# Altium project base-board_2.PrjPcb
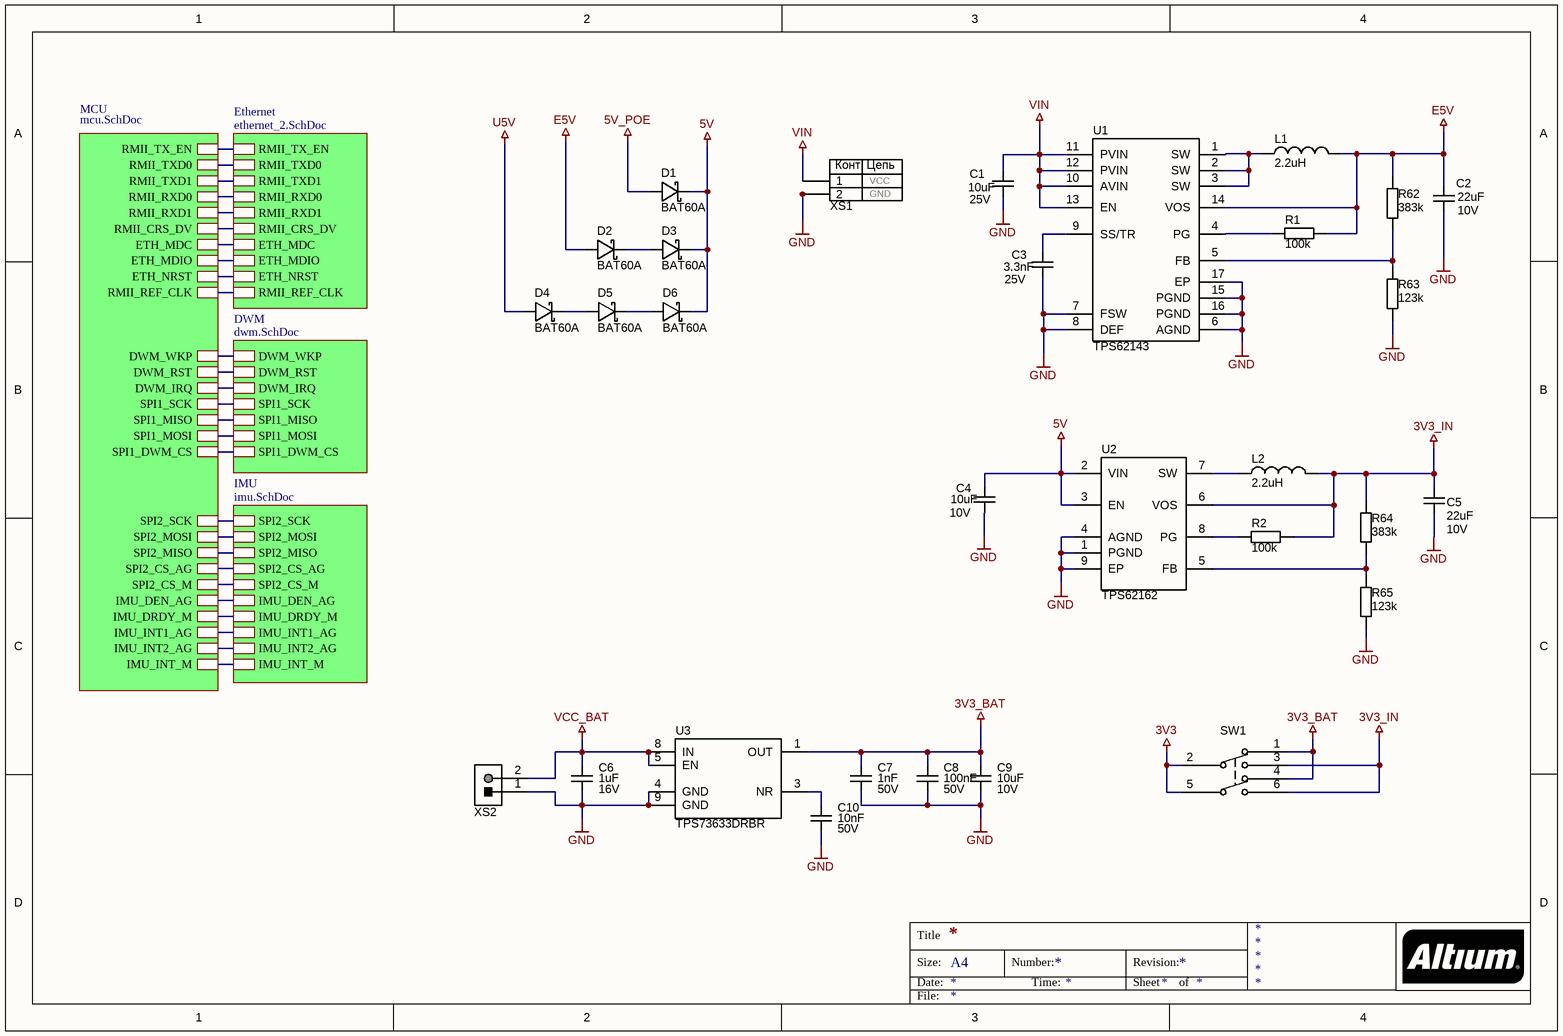
[diagram p0: base-board_2.SchDoc]
5 sheets, 193 parts. Net scope: hierarchical (ports join the sheet entries above them; power ports are global).
Board file: base-board_2.PcbDoc
Sheets:
  base-board_2.SchDoc
    Ethernet = ethernet_2.SchDoc
    MCU = mcu.SchDoc
    DWM = dwm.SchDoc
    IMU = imu.SchDoc

## Sheet base-board_2.SchDoc
size A4

### Parts
C1  value 10uF  Voltage: 25V  [C1210]  (hidden comment: C1210)
C2  value 22uF  Voltage: 10V  [C1210]  (hidden comment: C1210)
C3  value 3.3nF  Voltage: 25V  [C0603]  (hidden comment: C0603)
C4  value 10uF  Voltage: 10V  [C0805]  (hidden comment: C0805)
C5  value 22uF  Voltage: 10V  [C0805]  (hidden comment: C0805)
C6  value 1uF  Voltage: 16V  [C0805]  (hidden comment: C0805)
C7  value 1nF  Voltage: 50V  [C0805]  (hidden comment: C0805)
C8  value 100nF  Voltage: 50V  [C0603]  (hidden comment: C0603)
C9  value 10uF  Voltage: 10V  [C0603]  (hidden comment: C0603)
C10  value 10nF  Voltage: 50V  [C0603]  (hidden comment: C0603)
D1  BAT60A  [SOD-323-2]
D2  BAT60A  [SOD-323-2]
D3  BAT60A  [SOD-323-2]
D4  BAT60A  [SOD-323-2]
D5  BAT60A  [SOD-323-2]
D6  BAT60A  [SOD-323-2]
L1  value 2.2uH  [IND2220]  (hidden comment: LQH55PN2R2NR0)
L2  value 2.2uH  [IND2220]  (hidden comment: LQH55PN2R2NR0)
R1  value 100k  [SMD0603]  (hidden comment: R0603)
R2  value 100k  [SMD0603]  (hidden comment: R0603)
R62  value 383k  [SMD0603]  (hidden comment: R0603)
R63  value 123k  [SMD0603]  (hidden comment: R0603)
R64  value 383k  [SMD0603]  (hidden comment: R0603)
R65  value 123k  [SMD0603]  (hidden comment: R0603)
SW1  JS202011SCQN  [JS202011SCQN]  (value not drawn)
U1  TPS62143  [QFN-16]
U2  TPS62162  [SON-8]
U3  TPS73633DRBR  [VSON-8]
XS1  PowerJack  [PowerJack]  (value not drawn)
XS2  S2B-PH-K-S  [S2B-PH-K-S]  (value not drawn)

### Sub-sheets
DWM = dwm.SchDoc: DWM_WKP, DWM_RST, DWM_IRQ, SPI1_SCK, SPI1_MISO, SPI1_MOSI, SPI1_DWM_CS
Ethernet = ethernet_2.SchDoc: RMII_TX_EN, RMII_TXD0, RMII_TXD1, RMII_RXD0, RMII_RXD1, RMII_CRS_DV, ETH_MDC, ETH_MDIO, ETH_NRST, RMII_REF_CLK
IMU = imu.SchDoc: SPI2_SCK, SPI2_MOSI, SPI2_CS_M, IMU_DRDY_M, IMU_INT_M, IMU_INT2_AG, IMU_INT1_AG, SPI2_CS_AG, IMU_DEN_AG, SPI2_MISO
MCU = mcu.SchDoc: IMU_INT_M, IMU_DRDY_M, IMU_INT1_AG, IMU_INT2_AG, SPI2_CS_AG, IMU_DEN_AG, SPI2_CS_M, RMII_RXD0, RMII_RXD1, ETH_MDC, RMII_REF_CLK, ETH_MDIO, SPI2_SCK, RMII_TX_EN, RMII_TXD0, RMII_TXD1, SPI2_MISO, SPI2_MOSI, SPI1_MOSI, SPI1_MISO, RMII_CRS_DV, SPI1_SCK, SPI1_DWM_CS, DWM_WKP, DWM_RST, DWM_IRQ, ETH_NRST

### Nets
3V3: SW1.2(COM) SW1.5(COM)
3V3_BAT: C7.2 C8.2 C9.2 SW1.1 SW1.4 U3.1(OUT)
3V3_IN: C5.2 L2.2 R2.2 R64.2 SW1.3 SW1.6 U2.6(VOS)
5V: C4.2 D1.2(K) D3.2(K) D6.2(K) U2.2(VIN) U2.3(EN)
5V_POE: D1.1(A)
E5V: C2.2 D2.1(A) L1.2 R1.2 R62.2 U1.14(VOS)
GND: C1.1 C2.1 C3.1 C4.1 C5.1 C6.1 C7.1 C8.1 C9.1 C10.1 R63.1 R65.1 U1.6(AGND) U1.7(FSW) U1.8(DEF) U1.15(PGND) U1.16(PGND) U1.17(EP) U2.1(PGND) U2.4(AGND) U2.9(EP) U3.4(GND) U3.9(GND) XS1.2 XS1.3 XS2.1
U5V: D4.1(A)  [project net USB_VBUS]
VCC_BAT: C6.2 U3.5(EN) U3.8(IN) XS2.2
VIN: C1.2 U1.10(AVIN) U1.11(PVIN) U1.12(PVIN) U1.13(EN) XS1.1
DWM_CS: sheet MCU/SPI1_DWM_CS, sheet DWM/SPI1_DWM_CS
DWM_MISO: sheet MCU/SPI1_MISO, sheet DWM/SPI1_MISO
DWM_MOSI: sheet MCU/SPI1_MOSI, sheet DWM/SPI1_MOSI
DWM_SCK: sheet MCU/SPI1_SCK, sheet DWM/SPI1_SCK
RESET: sheet Ethernet/ETH_NRST, sheet MCU/ETH_NRST
NetC3_2: C3.2 U1.9(SS/TR)
NetC10_2: C10.2 U3.3(NR)
NetD2_2: D2.2(K) D3.1(A)
NetD4_2: D4.2(K) D5.1(A)
NetD5_2: D5.2(K) D6.1(A)
NetL1_1: L1.1 U1.1(SW) U1.2(SW) U1.3(SW)
NetL2_1: L2.1 U2.7(SW)
NetR1_1: R1.1 U1.4(PG)
NetR2_1: R2.1 U2.8(PG)
NetR8_2: sheet MCU/DWM_IRQ, sheet DWM/DWM_IRQ
NetR21_1: sheet Ethernet/ETH_MDIO, sheet MCU/ETH_MDIO
NetR22_1: sheet Ethernet/RMII_REF_CLK, sheet MCU/RMII_REF_CLK
NetR23_2: sheet Ethernet/RMII_RXD0, sheet MCU/RMII_RXD0
NetR24_2: sheet Ethernet/RMII_RXD1, sheet MCU/RMII_RXD1
NetR27_2: sheet Ethernet/RMII_CRS_DV, sheet MCU/RMII_CRS_DV
NetR62_1: R62.1 R63.2 U1.5(FB)
NetR64_1: R64.1 R65.2 U2.5(FB)
NetU4_16: sheet Ethernet/ETH_MDC, sheet MCU/ETH_MDC
NetU4_39: sheet MCU/DWM_WKP, sheet DWM/DWM_WKP
NetU4_40: sheet MCU/DWM_RST, sheet DWM/DWM_RST
NetU4_47: sheet MCU/SPI2_SCK, sheet IMU/SPI2_SCK
NetU4_48: sheet Ethernet/RMII_TX_EN, sheet MCU/RMII_TX_EN
NetU4_51: sheet Ethernet/RMII_TXD0, sheet MCU/RMII_TXD0
NetU4_52: sheet Ethernet/RMII_TXD1, sheet MCU/RMII_TXD1
NetU4_53: sheet MCU/SPI2_MISO, sheet IMU/SPI2_MISO
NetU4_54: sheet MCU/SPI2_MOSI, sheet IMU/SPI2_MOSI
NetU4_55: sheet MCU/IMU_DEN_AG, sheet IMU/IMU_DEN_AG
NetU4_56: sheet MCU/SPI2_CS_AG, sheet IMU/SPI2_CS_AG
NetU4_57: sheet MCU/SPI2_CS_M, sheet IMU/SPI2_CS_M
NetU4_58: sheet MCU/IMU_DRDY_M, sheet IMU/IMU_DRDY_M
NetU4_59: sheet MCU/IMU_INT1_AG, sheet IMU/IMU_INT1_AG
NetU4_60: sheet MCU/IMU_INT2_AG, sheet IMU/IMU_INT2_AG
NetU4_61: sheet MCU/IMU_INT_M, sheet IMU/IMU_INT_M

### Notes on the sheet
- Title
- Size:
- Date:
- A4
- Number:
- Time:
- Revision:
- Sheet
- of
- File:
- (in symbol PowerJack) Конт; Цепь; VCC; GND

### Library data of the parts
D1-D6 = BAT60J: Shottky Diode 10V 3A
L1 L2 = LQH55PN2R2NR0: FIXED IND 2.2UH 2.5A 31 MOHM SMD; Model: LQH55PN2R2NR0
SW1 = JS202011SCQN: Switch Slide DPDT, 0.3 A, 6 V, -40 to 85 degC, 6-Pin SMD, RoHS, Tape and Reel; Manufacturer: C&K Components; Contact Rating @ Voltage: 0.3@6VDCA; COO: US; Maximum DC Voltage Rating: 6V; Minimum Insulation Resistance: 100MOhm; Actuator Color: Black; Body Orientation: Straight; Actuator Material: Nylon4/6; Dielectric Strength: 500VAC; Maximum Contact Resistance: 70mOhm; Actuator Style: TopSlide; Electrical Life: 15000Cycles; Seal Location: N/A; Base Material: N/A; Mechanical Life: N/A; Switch Configuration: N/A; HTS: 8536509050; Contact Material: CopperAlloy; Supplier Standard Pack: 5,000; Manufacturer URL: http://www.ckswitches.com; Supplier: C&KComponents; Datasheet URL: http://datasheet.octopart.com/JS202011SCQN-C%26K-Components-datasheet-62100994.pdf; Housing Material: Nylon4/6; Product Weight: N/A; Dimension: 9x7.5x5.5mm; Maximum AC Voltage Rating: N/A; ECCN: EAR99; Contact Plating: Silver; Pole Throw Configuration: DPDT; Packaging: TapeandReel; Part No: JS202011SCQN; Datasheet Version: Sep-15; Seal Description: N/A; RoHS: Yes; Mounting: SurfaceMount,GullWing; Family: JS; Type: Sub-Miniature; Operating Temperature: -40to85C
U1 = TPS62143RGT16: Buck 2A TI Fix 5V
U2 = TPS62162DSG8: Buck 1A TI Fix 3.3V
U3 = TPS73633DRBR: IC REG LINEAR 3.3V 400MA 8SON
XS2 = S2B-PH-K-S: Male Header, Pitch 2 mm, 1 x 2 Position, Height 4.8 mm, Tail Length 3.4 mm, -25 to 85 degC, RoHS, Bulk; Case\Package: Radial; Tolerance: 20%; Capacitance: 10 uF; Voltage Rating (DC): 50 V; Packaging: Bulk; ComponentLink1URL: http://www.jst-mfg.com/product/pdf/eng/ePH.pdf; Radiation Hardening: No; Height: 11 mm; Package Quantity: 200; PackageDescription: Male Header, Pitch 2 mm, 1 x 2 Position, Height 4.8 mm, Tail Length 3.4 mm; PackageReference: S2B-PH-K-S; Diameter: 5 mm; Pins: 2; Mount: Through Hole; Max Operating Temperature: 85 degC; Min Operating Temperature: -40 degC; ComponentLink1Description: Datasheet; DatasheetVersion: Dec-12; Length: 11 mm; Lead Pitch: 2 mm; REACH SVHC: No SVHC; Voltage Rating: 50 V; RoHSCompliant: true
C1 C2 = C1210: Model: *
C3 C8-C10 = C0603: Model: *
C4-C7 = C0805: Model: *

## Sheet ethernet_2.SchDoc
size A2; Scale: 1:1; DocumentType: Схема электрическая принципиальная; FirstReferrence: АБВГ.123456.001
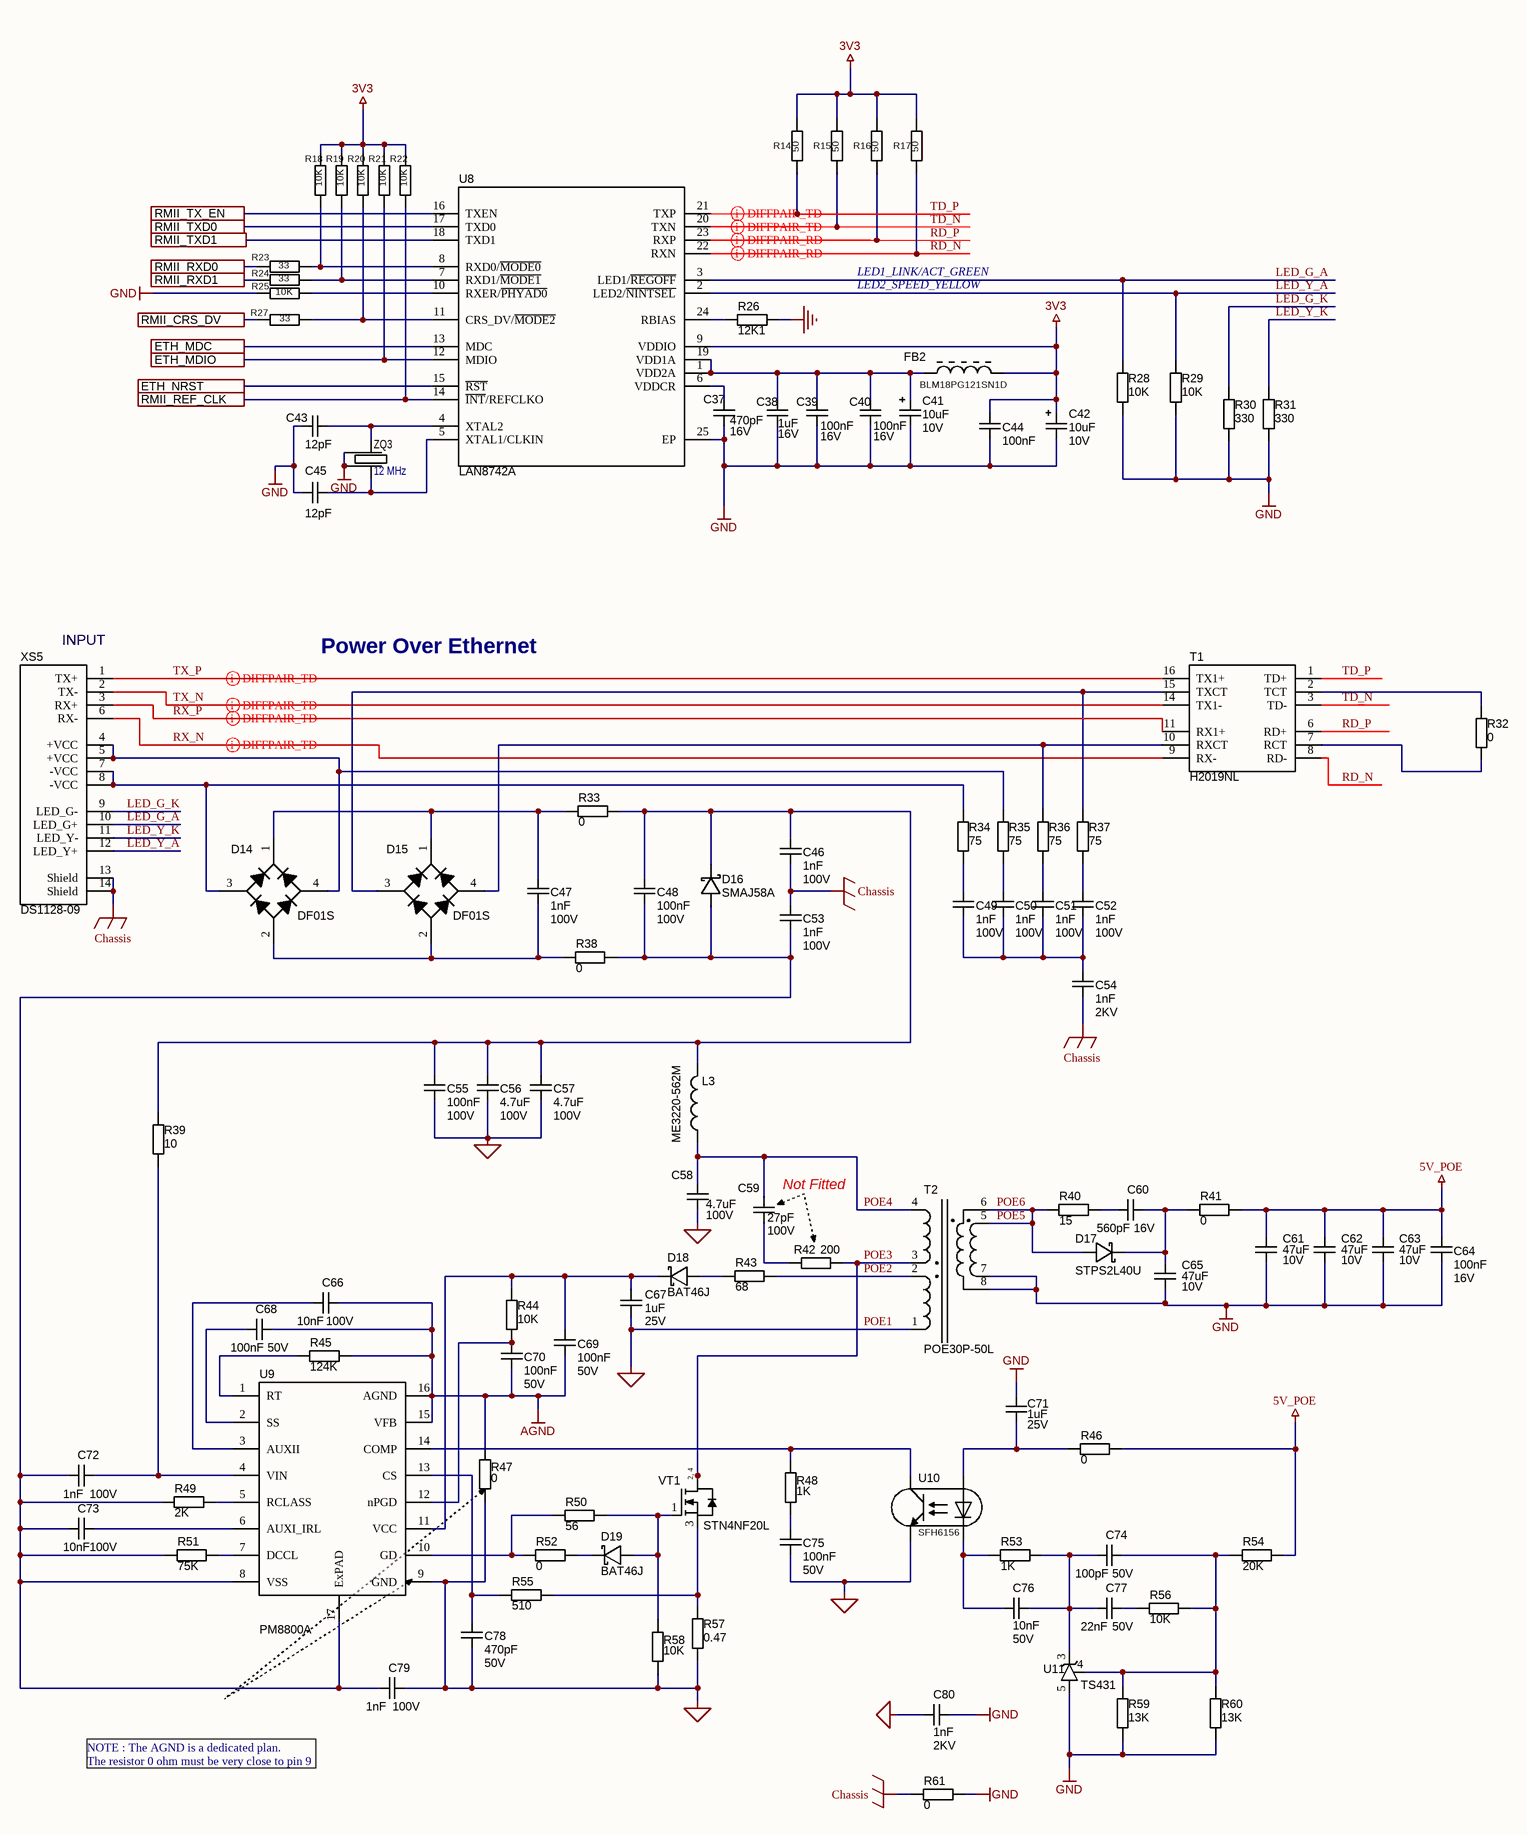
[diagram p1: ethernet_2.SchDoc]

### Parts
C37  value 470pF  Voltage: 16V  [C0603]  (hidden comment: C0603)
C38  value 1uF  Voltage: 16V  [C0603]  (hidden comment: C0603)
C39  value 100nF  Voltage: 16V  [C0603]  (hidden comment: C0603)
C40  value 100nF  Voltage: 16V  [C0603]  (hidden comment: C0603)
C41  value 10uF  Voltage: 10V  [TPSA106K010R1800]  (hidden comment: TPSA106K010R0900)
C42  value 10uF  Voltage: 10V  [TPSA106K010R1800]  (hidden comment: TPSA106K010R0900)
C43  value 12pF  [C0603]  (hidden comment: C0603)
C44  value 100nF  [C0603]  (hidden comment: C0603)
C45  value 12pF  [C0603]  (hidden comment: C0603)
C46  value 1nF  Voltage: 100V  [C0603]  (hidden comment: C0603)
C47  value 1nF  Voltage: 100V  [C0603]  (hidden comment: C0603)
C48  value 100nF  Voltage: 100V  [C0805]  (hidden comment: C0805)
C49  value 1nF  Voltage: 100V  [C0603]  (hidden comment: C0603)
C50  value 1nF  Voltage: 100V  [C0603]  (hidden comment: C0603)
C51  value 1nF  Voltage: 100V  [C0603]  (hidden comment: C0603)
C52  value 1nF  Voltage: 100V  [C0603]  (hidden comment: C0603)
C53  value 1nF  Voltage: 100V  [C0603]  (hidden comment: C0603)
C54  value 1nF  Voltage: 2KV  [C1206(3216)]  (hidden comment: C1206)
C55  value 100nF  Voltage: 100V  [C0805]  (hidden comment: C0805)
C56  value 4.7uF  Voltage: 100V  [C2220]  (hidden comment: C2220)
C57  value 4.7uF  Voltage: 100V  [C2220]  (hidden comment: C2220)
C58  value 4.7uF  Voltage: 100V  [C2220]  (hidden comment: C2220)
C59  value 27pF  Voltage: 100V  [C0603]  (hidden comment: C0603)
C60  value 560pF  Voltage: 16V  [C0603]  (hidden comment: C0603)
C61  value 47uF  Voltage: 10V  [C0805]  (hidden comment: C0805)
C62  value 47uF  Voltage: 10V  [C0805]  (hidden comment: C0805)
C63  value 47uF  Voltage: 10V  [C0805]  (hidden comment: C0805)
C64  value 100nF  Voltage: 16V  [C0603]  (hidden comment: C0603)
C65  value 47uF  Voltage: 10V  [C0805]  (hidden comment: C0805)
C66  value 10nF  Voltage: 100V  [C0603]  (hidden comment: C0603)
C67  value 1uF  Voltage: 25V  [C0603]  (hidden comment: C0603)
C68  value 100nF  Voltage: 50V  [C0603]  (hidden comment: C0603)
C69  value 100nF  Voltage: 50V  [C0603]  (hidden comment: C0603)
C70  value 100nF  Voltage: 50V  [C0603]  (hidden comment: C0603)
C71  value 1uF  Voltage: 25V  [C0603]  (hidden comment: C0603)
C72  value 1nF  Voltage: 100V  [C0603]  (hidden comment: C0603)
C73  value 10nF  Voltage: 100V  [C0603]  (hidden comment: C0603)
C74  value 100pF  Voltage: 50V  [C0603]  (hidden comment: C0603)
C75  value 100nF  Voltage: 50V  [C0603]  (hidden comment: C0603)
C76  value 10nF  Voltage: 50V  [C0603]  (hidden comment: C0603)
C77  value 22nF  Voltage: 50V  [C0603]  (hidden comment: C0603)
C78  value 470pF  Voltage: 50V  [C0603]  (hidden comment: C0603)
C79  value 1nF  Voltage: 100V  [C0603]  (hidden comment: C0603)
C80  value 1nF  Voltage: 2KV  [C1206(3216)]  (hidden comment: C1206)
D14  DF01S  [SDIP-4]
D15  DF01S  [SDIP-4]
D16  SMAJ58A  [DO-214AC-2_N]
D17  STPS2L40U  [SMB-2]
D18  BAT46J  [SOD-323-2]
D19  BAT46J  [SOD-323-2]
FB2  BLM18PG121SN1D  [BLM18]
L3  Model: ME3220-562M  [ME3220]  (hidden comment: ME3220)
R14  value 50  [SMD0603]  (hidden comment: R0603)
R15  value 50  [SMD0603]  (hidden comment: R0603)
R16  value 50  [SMD0603]  (hidden comment: R0603)
R17  value 50  [SMD0603]  (hidden comment: R0603)
R18  value 10K  [SMD0603]  (hidden comment: R0603)
R19  value 10K  [SMD0603]  (hidden comment: R0603)
R20  value 10K  [SMD0603]  (hidden comment: R0603)
R21  value 10K  [SMD0603]  (hidden comment: R0603)
R22  value 10K  [SMD0603]  (hidden comment: R0603)
R23  value 33  [SMD0603]  (hidden comment: R0603)
R24  value 33  [SMD0603]  (hidden comment: R0603)
R25  value 10K  [SMD0603]  (hidden comment: R0603)
R26  value 12K1  [SMD0603]  (hidden comment: R0603)
R27  value 33  [SMD0603]  (hidden comment: R0603)
R28  value 10K  [SMD0603]  (hidden comment: R0603)
R29  value 10K  [SMD0603]  (hidden comment: R0603)
R30  value 330  [SMD0603]  (hidden comment: R0603)
R31  value 330  [SMD0603]  (hidden comment: R0603)
R32  value 0  [SMD0805]  (hidden comment: R0805)
R33  value 0  [SMD0805]  (hidden comment: R0805)
R34  value 75  [SMD0805]  (hidden comment: R0805)
R35  value 75  [SMD0805]  (hidden comment: R0805)
R36  value 75  [SMD0805]  (hidden comment: R0805)
R37  value 75  [SMD0805]  (hidden comment: R0805)
R38  value 0  [SMD0805]  (hidden comment: R0805)
R39  value 10  [SMD0805]  (hidden comment: R0805)
R40  value 15  [SMD0805]  (hidden comment: R0805)
R41  value 0  [SMD0603]  (hidden comment: R0603)
R42  value 200  [R1206(3216)]  (hidden comment: R1206)
R43  value 68  [SMD0805]  (hidden comment: R0805)
R44  value 10K  [SMD0603]  (hidden comment: R0603)
R45  value 124K  [SMD0603]  (hidden comment: R0603)
R46  value 0  [SMD0805]  (hidden comment: R0805)
R47  value 0  [SMD0603]  (hidden comment: R0603)
R48  value 1K  [SMD0603]  (hidden comment: R0603)
R49  value 2K  [SMD0603]  (hidden comment: R0603)
R50  value 56  [SMD0805]  (hidden comment: R0805)
R51  value 75K  [SMD0603]  (hidden comment: R0603)
R52  value 0  [SMD0603]  (hidden comment: R0603)
R53  value 1K  [SMD0603]  (hidden comment: R0603)
R54  value 20K  [SMD0603]  (hidden comment: R0603)
R55  value 510  [SMD0603]  (hidden comment: R0603)
R56  value 10K  [SMD0603]  (hidden comment: R0603)
R57  value 0.47  [R1206(3216)]  (hidden comment: R1206)
R58  value 10K  [SMD0603]  (hidden comment: R0603)
R59  value 13K  [SMD0603]  (hidden comment: R0603)
R60  value 13K  [SMD0603]  (hidden comment: R0603)
R61  value 0  [SMD0805]  (hidden comment: R0805)
T1  H2019NL  [H2019NL]
T2  POE30P-50L  [POE30P]
U8  LAN8742A  [QFN-24]
U9  PM8800A  [HTSSOP16]
U10  SFH6156  [SFH6156(VISH)]
U11  TS431  [SOT-23-5]
VT1  STN4NF20L  [SOT-223]
XS5  DS1128-09  [RJ45-AMPH]
ZQ3  12 MHz  [NX3225]

### Ports
ETH_MDC, ETH_MDIO, ETH_NRST, RMII_CRS_DV, RMII_REF_CLK, RMII_RXD0, RMII_RXD1, RMII_TX_EN, RMII_TXD0, RMII_TXD1

### Nets
3V3: C42.1 C44.1 FB2.2 R14.2 R15.2 R16.2 R17.2 R18.2 R19.2 R20.2 R21.2 R22.2 U8.9(VDDIO)
5V_POE: C61.2 C62.2 C63.2 C64.1 R41.2 R46.2 R54.1
AGND: C66.2 C68.2 C69.1 C70.1 R45.2 R47.2 U9.15(VFB) U9.16(AGND)
Chassis: C46.1 C53.2 C54.1 R61.1 XS5.13(Shield) XS5.14(Shield)
GND: C37.2 C38.2 C39.2 C40.2 C41.2 C42.2 C43.2 C44.2 C45.2 C61.1 C62.1 C63.1 C64.2 C65.1 C71.2 C80.2 R25.1 R26.1 R28.1 R29.1 R30.1 R31.1 R59.2 R60.2 R61.2 T2.7 T2.8 U8.25(EP) U11.5(A) ZQ3.2 ZQ3.4
POE1: C55.1 C56.1 C57.1 C58.2 C67.1 C75.1 C78.1 C79.1 C80.1 R47.1 R57.1 R58.1 T2.1 U9.9(GND) U10.3(E)  [also labelled GND_POWER_IN]
LED_G_A: R28.2 U8.3(LED1/~{REGOFF}) XS5.10(LED_G+)
LED_G_K: R30.2 XS5.9(LED_G-)
LED_Y_A: R29.2 U8.2(LED2/~{NINTSEL}) XS5.12(LED_Y+)
LED_Y_K: R31.2 XS5.11(LED_Y-)
POE2: R43.2 T2.2
POE3: R42.2 T2.3 VT1.2(D) VT1.4(D)
POE4: C58.1 C59.2 L3.1 T2.4
POE5: D17.1(A) R40.1 T2.5 T2.6  [also labelled POE6]
RD_N: R17.1 T1.8(RD-) U8.22(RXN)
RD_P: R16.1 T1.6(RD+) U8.23(RXP)
RESET: U8.15(~{RST}) ; port ETH_NRST
RX_N: T1.9(RX-) XS5.6(RX-)
RX_P: T1.11(RX1+) XS5.3(RX+)
TD_N: R15.1 T1.3(TD-) U8.20(TXN)
TD_P: R14.1 T1.1(TD+) U8.21(TXP)
TX_N: T1.14(TX1-) XS5.2(TX-)
TX_P: T1.16(TX1+) XS5.1(TX+)
NetC37_1: C37.1 U8.6(VDDCR)
NetC38_1: C38.1 C39.1 C40.1 C41.1 FB2.1 U8.1(VDD2A) U8.19(VDD1A)
NetC43_1: C43.1 U8.4(XTAL2) ZQ3.3
NetC45_1: C45.1 U8.5(XTAL1/CLKIN) ZQ3.1
NetC46_2: C46.2 C48.2 C55.2 C56.2 C57.2 D16.2(K) L3.2 R33.2 R39.2
NetC47_1: C47.1 D14.2(A) D15.2(A) R38.1
NetC47_2: C47.2 D14.1(K) D15.1(K) R33.1
NetC48_1: C48.1 C53.1 C72.1 C73.1 C79.2 D16.1(A) R38.2 R49.1 R51.1 U9.8(VSS) U9.17(ExPAD)
NetC49_1: C49.1 C50.1 C51.1 C52.1 C54.2
NetC49_2: C49.2 R34.1
NetC50_2: C50.2 R35.1
NetC51_2: C51.2 R36.1
NetC52_2: C52.2 R37.1
NetC59_1: C59.1 R42.1
NetC60_1: C60.1 C65.2 D17.2(K) R41.1
NetC60_2: C60.2 R40.2
NetC66_1: C66.1 U9.3(AUXII)
NetC67_2: C67.2 C69.2 D18.2(K) R44.1 U9.11(VCC)
NetC68_1: C68.1 U9.2(SS)
NetC70_2: C70.2 R44.2 U9.12(nPGD)
NetC71_1: C71.1 R46.1 U10.1(A)
NetC72_2: C72.2 R39.1 U9.4(VIN)
NetC73_2: C73.2 U9.6(AUXI_IRL)
NetC74_1: C74.1 R54.2 R56.1 R59.1 R60.1 U11.4
NetC74_2: C74.2 C76.1 C77.1 R53.1 U11.3(K)
NetC75_2: C75.2 R48.1
NetC76_2: C76.2 R53.2 U10.2(C)
NetC77_2: C77.2 R56.2
NetC78_2: C78.2 R55.1 U9.13(CS)
NetD14_3: D14.3(C) R34.2 XS5.7(-VCC) XS5.8(-VCC)
NetD14_4: D14.4(C) R35.2 XS5.4(+VCC) XS5.5(+VCC)
NetD15_3: D15.3(C) R37.2 T1.15(TXCT)
NetD15_4: D15.4(C) R36.2 T1.10(RXCT)
NetD18_1: D18.1(A) R43.1
NetD19_1: D19.1(A) R50.2 R58.2 VT1.1(G)
NetD19_2: D19.2(K) R52.2
NetR18_1: R18.1 R23.1 U8.8(RXD0/~{MODE0})
NetR19_1: R19.1 R24.1 U8.7(RXD1/~{MODE1})
NetR20_1: R20.1 R27.1 U8.11(CRS_DV/~{MODE2})
NetR21_1: R21.1 U8.12(MDIO) ; port ETH_MDIO
NetR22_1: R22.1 U8.14(~{INT}/REFCLKO) ; port RMII_REF_CLK
NetR23_2: R23.2 ; port RMII_RXD0
NetR24_2: R24.2 ; port RMII_RXD1
NetR25_2: R25.2 U8.10(RXER/~{PHYAD0})
NetR26_2: R26.2 U8.24(RBIAS)
NetR27_2: R27.2 ; port RMII_CRS_DV
NetR32_1: R32.1 T1.2(TCT)
NetR32_2: R32.2 T1.7(RCT)
NetR45_1: R45.1 U9.1(RT)
NetR48_2: R48.2 U9.14(COMP) U10.4(C)
NetR49_2: R49.2 U9.5(RCLASS)
NetR50_1: R50.1 R52.1 U9.10(GD)
NetR51_2: R51.2 U9.7(DCCL)
NetR55_2: R55.2 R57.2 VT1.3(S)
NetU4_16: U8.13(MDC) ; port ETH_MDC
NetU4_48: U8.16(TXEN) ; port RMII_TX_EN
NetU4_51: U8.17(TXD0) ; port RMII_TXD0
NetU4_52: U8.18(TXD1) ; port RMII_TXD1

### Layout directives
differential pair: RD_N, RD_P, RX_N, RX_P, TD_N, TD_P, TX_N, TX_P

### Notes on the sheet
- LED2_SPEED_YELLOW
- LED1_LINK/ACT_GREEN
- (near XS5) INPUT
- Power Over Ethernet
- (near C59) Not Fitted
- NOTE : The AGND is a dedicated plan.
  The resistor 0 ohm must be very close to pin 9
- Title
- Size:
- Date:
- File:
- A2
- Number:
- Time:
- Revision:
- Sheet
- of
- (in symbol STN4NF20L) 2, 4

### Library data of the parts
C41 C42 = TPSA106K010R0900: CAP TANT 10UF 10% 10V 1206; Model: TPSA106K010R0900
C43 C45 = C0603: Voltage: *V; Model: *
C44 = C0603: Voltage: 16V; Model: *
C55 = C0805: Model: 08051C104KAT2A
C61-C63 C65 = C0805: Model: GRM21BR61A476ME15L
D14 D15 = DF01S: BRIDGE RECT 1P 100V 1.5A 4SDIP
D16 = SMAJ58A: TVS DIODE 58V 93.6V DO214AC
D17 = STPS2L40U: DIODE SCHOTTKY 40V 2A SMB
D18 D19 = BAT46J: DIODE SCHOTTKY 100V 150MA SOD323
FB2 = BLM18: Ferrite Bead 0603; Resistance: * Ohm; DC Current Rating: * A
L3 = ME3220: SMT Power Inductor; Value: *
T1 = H2019NL: MODULE XFRMR VOIP SGL LAN 16SOIC; MF: Pulse Electronics; Package: SOIC-16 Pulse; Availability: Unavailable; MP: H2019NL; Price: None; SnapEDA_Link: https://www.snapeda.com/parts/H2019NL/Pulse%20Electronics%20Network/view-part/?ref=snap; Value: *
T2 = POE30P-50L: PoE transformer, SMT
U8 = LAN8742A: RMII 10/100 Eth Transceiver Microchip
U11 = TS431: IC VREF SHUNT ADJ SOT23-5
VT1 = STN4NF20L: MOSFET N-CH 200V 1A
XS5 = DS1128-09: Single Port RJ45 Connector
ZQ3 = Crystal_4: DSX321G
C37-C40 C46 C47 C49-C53 C59 C60 C64 C66-C79 = C0603: Model: *
C48 = C0805: Model: *
C54 C80 = C1206: Model: *
C56-C58 = C2220: Model: *

## Sheet mcu.SchDoc
size A3; Scale: 1:1; DocumentType: Схема электрическая принципиальная; FirstReferrence: АБВГ.123456.001
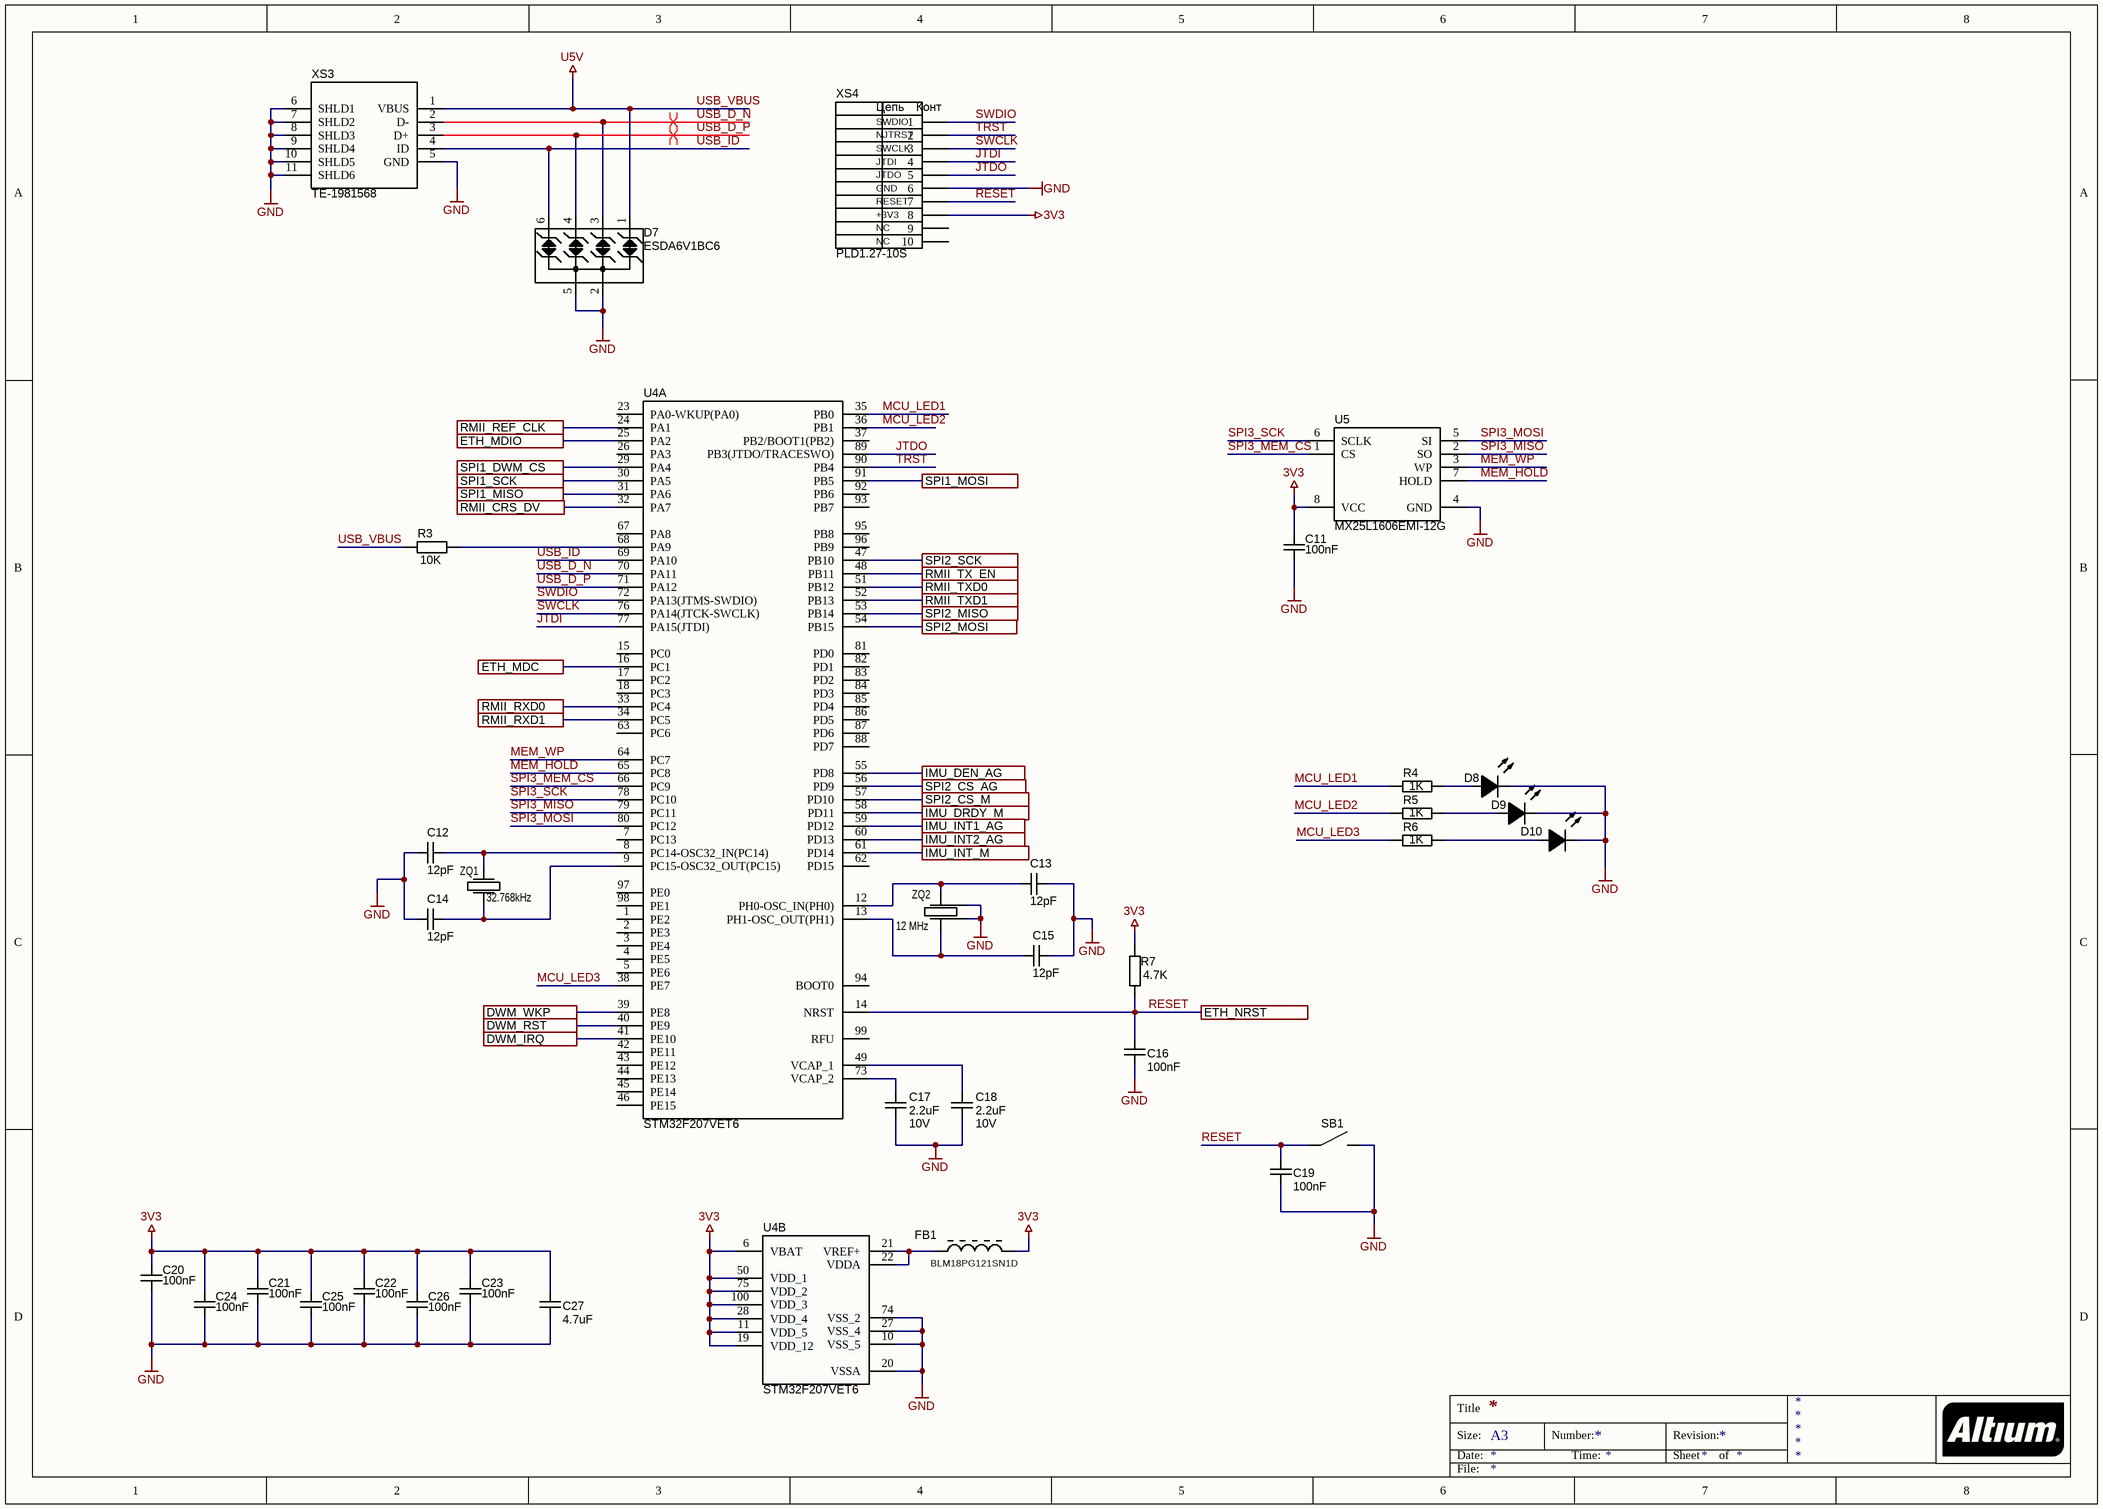
[diagram p2: mcu.SchDoc]

### Parts
C11  value 100nF  [C0603]  (hidden comment: C0603)
C12  value 12pF  [C0603]  (hidden comment: C0603)
C13  value 12pF  [C0603]  (hidden comment: C0603)
C14  value 12pF  [C0603]  (hidden comment: C0603)
C15  value 12pF  [C0603]  (hidden comment: C0603)
C16  value 100nF  [C0603]  (hidden comment: C0603)
C17  value 2.2uF  Voltage: 10V  [C1206(3216)]  (hidden comment: C1206)
C18  value 2.2uF  Voltage: 10V  [C1206(3216)]  (hidden comment: C1206)
C19  value 100nF  [C0603]  (hidden comment: C0603)
C20  value 100nF  [C0603]  (hidden comment: C0603)
C21  value 100nF  [C0603]  (hidden comment: C0603)
C22  value 100nF  [C0603]  (hidden comment: C0603)
C23  value 100nF  [C0603]  (hidden comment: C0603)
C24  value 100nF  [C0603]  (hidden comment: C0603)
C25  value 100nF  [C0603]  (hidden comment: C0603)
C26  value 100nF  [C0603]  (hidden comment: C0603)
C27  value 4.7uF  [C0603]  (hidden comment: C0603)
D7  ESDA6V1BC6  [SOT-23-6]
D8  LED0805  [LED0805]  (value not drawn)
D9  LED0805  [LED0805]  (value not drawn)
D10  LED0805  [LED0805]  (value not drawn)
FB1  BLM18PG121SN1D  [BLM18]
R3  value 10K  [SMD0603]
R4  1K  [SMD0603]
R5  value 1K  [SMD0603]
R6  value 1K  [SMD0603]
R7  value 4.7K  [SMD0603]  (hidden comment: R0603)
SB1  FSMSM  [FSMSM-2]  (value not drawn)
U4  STM32F207VET6  [STM-LQFP100_V]  (parts A,B of 2)
U5  MX25L1606EMI-12G  [SOP-8]
XS3  TE-1981568  [TECO-1981568-5_V]
XS4  PLD1.27-10S  [PLD1.27-10S]
ZQ1  32.768kHz  [DST210A]
ZQ2  12 MHz  [NX3225]

### Ports
DWM_IRQ, DWM_RST, DWM_WKP, ETH_MDC, ETH_MDIO, ETH_NRST, IMU_DEN_AG, IMU_DRDY_M, IMU_INT1_AG, IMU_INT2_AG, IMU_INT_M, RMII_CRS_DV, RMII_REF_CLK, RMII_RXD0, RMII_RXD1, RMII_TX_EN, RMII_TXD0, RMII_TXD1, SPI1_DWM_CS, SPI1_MISO, SPI1_MOSI, SPI1_SCK, SPI2_CS_AG, SPI2_CS_M, SPI2_MISO, SPI2_MOSI, SPI2_SCK

### Nets
3V3: C11.2 C20.2 C21.2 C22.2 C23.2 C24.2 C25.2 C26.2 C27.1 FB1.2 R7.2 U4.6(VBAT) U4.11(VDD_5) U4.19(VDD_12) U4.28(VDD_4) U4.50(VDD_1) U4.75(VDD_2) U4.100(VDD_3) U5.8(VCC) XS4.8
GND: C11.1 C12.1 C13.2 C14.1 C15.2 C16.1 C17.1 C18.1 C19.1 C20.1 C21.1 C22.1 C23.1 C24.1 C25.1 C26.1 C27.2 D7.2(IO2) D7.5(IO4) D8.1(K) D9.1(K) D10.1(K) SB1.2 U4.10(VSS_5) U4.20(VSSA) U4.27(VSS_4) U4.74(VSS_2) U5.4(GND) XS3.5(GND) XS3.6(SHLD1) XS3.7(SHLD2) XS3.8(SHLD3) XS3.9(SHLD4) XS3.10(SHLD5) XS3.11(SHLD6) XS4.6 ZQ2.2 ZQ2.4
USB_VBUS: D7.1(IO1) R3.1 XS3.1(VBUS)  [also labelled U5V]
DWM_CS: U4.29(PA4) ; port SPI1_DWM_CS
DWM_MISO: U4.31(PA6) ; port SPI1_MISO
DWM_MOSI: U4.91(PB5) ; port SPI1_MOSI
DWM_SCK: U4.30(PA5) ; port SPI1_SCK
JTDI: U4.77(PA15(JTDI)) XS4.4
JTDO: U4.89(PB3(JTDO/TRACESWO)) XS4.5
MCU_LED1: R4.2 U4.35(PB0)
MCU_LED2: R5.2 U4.36(PB1)
MCU_LED3: R6.2 U4.38(PE7)
MEM_HOLD: U4.65(PC8) U5.7(HOLD)
MEM_WP: U4.64(PC7) U5.3(WP)
RESET: C16.2 C19.2 R7.1 SB1.1 U4.14(NRST) XS4.7 ; port ETH_NRST
SPI3_MEM_CS: U4.66(PC9) U5.1(CS)
SPI3_MISO: U4.79(PC11) U5.2(SO)
SPI3_MOSI: U4.80(PC12) U5.5(SI)
SPI3_SCK: U4.78(PC10) U5.6(SCLK)
SWCLK: U4.76(PA14(JTCK-SWCLK)) XS4.3
SWDIO: U4.72(PA13(JTMS-SWDIO)) XS4.1
TRST: U4.90(PB4) XS4.2
USB_D_N: D7.3(GND) U4.70(PA11) XS3.2(D-)
USB_D_P: D7.4(IO3) U4.71(PA12) XS3.3(D+)
USB_ID: D7.6(NC) U4.69(PA10) XS3.4(ID)
NetC12_2: C12.2 U4.8(PC14-OSC32_IN(PC14)) ZQ1.2(OSC2)
NetC13_1: C13.1 U4.12(PH0-OSC_IN(PH0)) ZQ2.3
NetC14_2: C14.2 U4.9(PC15-OSC32_OUT(PC15)) ZQ1.1(OSC1)
NetC15_1: C15.1 U4.13(PH1-OSC_OUT(PH1)) ZQ2.1
NetC17_2: C17.2 U4.73(VCAP_2)
NetC18_2: C18.2 U4.49(VCAP_1)
NetD8_2: D8.2(A) R4.1
NetD9_2: D9.2(A) R5.1
NetD10_2: D10.2(A) R6.1
NetFB1_1: FB1.1 U4.21(VREF+) U4.22(VDDA)
NetR3_2: R3.2 U4.68(PA9)
NetR8_2: U4.41(PE10) ; port DWM_IRQ
NetR21_1: U4.25(PA2) ; port ETH_MDIO
NetR22_1: U4.24(PA1) ; port RMII_REF_CLK
NetR23_2: U4.33(PC4) ; port RMII_RXD0
NetR24_2: U4.34(PC5) ; port RMII_RXD1
NetR27_2: U4.32(PA7) ; port RMII_CRS_DV
NetU4_16: U4.16(PC1) ; port ETH_MDC
NetU4_39: U4.39(PE8) ; port DWM_WKP
NetU4_40: U4.40(PE9) ; port DWM_RST
NetU4_47: U4.47(PB10) ; port SPI2_SCK
NetU4_48: U4.48(PB11) ; port RMII_TX_EN
NetU4_51: U4.51(PB12) ; port RMII_TXD0
NetU4_52: U4.52(PB13) ; port RMII_TXD1
NetU4_53: U4.53(PB14) ; port SPI2_MISO
NetU4_54: U4.54(PB15) ; port SPI2_MOSI
NetU4_55: U4.55(PD8) ; port IMU_DEN_AG
NetU4_56: U4.56(PD9) ; port SPI2_CS_AG
NetU4_57: U4.57(PD10) ; port SPI2_CS_M
NetU4_58: U4.58(PD11) ; port IMU_DRDY_M
NetU4_59: U4.59(PD12) ; port IMU_INT1_AG
NetU4_60: U4.60(PD13) ; port IMU_INT2_AG
NetU4_61: U4.61(PD14) ; port IMU_INT_M

Not connected (* = marked no-connect by the designer): U4 1(PE2) 2(PE3) 3(PE4) 4(PE5) 5(PE6) 7(PC13) 15(PC0) 17(PC2) 18(PC3) 23(PA0-WKUP(PA0)) 26(PA3) 37(PB2/BOOT1(PB2)) 42(PE11) 43(PE12) 44(PE13) 45(PE14) 46(PE15) 62(PD15) 63(PC6) 67(PA8) 81(PD0) 82(PD1) 83(PD2) 84(PD3) 85(PD4) 86(PD5) 87(PD6) 88(PD7) 92(PB6) 93(PB7) 94(BOOT0) 95(PB8) 96(PB9) 97(PE0) 98(PE1) 99(RFU); XS4 9 10

### Layout directives
differential pair: USB_D_N, USB_D_P

### Notes on the sheet
- Title
- Size:
- Date:
- A3
- Number:
- Time:
- Revision:
- Sheet
- of
- File:
- (in symbol PLD1.27-10-MCU) Цепь; Конт; SWDIO; NJTRST; SWCLK; JTDI; JTDO; GND; RESET; +3V3; NC

### Library data of the parts
C11 C13 C15 C16 C19-C27 = C0603: Voltage: 10V; Model: *
C12 C14 = C0603: Voltage: *V; Model: *
C17 C18 = C1206: Model: CC1206KKX7R6BB225
D7 = ESDA6V1BC6: 4-line ESD protection; Manuf_1: STM; Manuf_Part_1: ESDA5V3L; Ref St: 9179034; Provided: ST; ECCN_US/EU: EAR99/NEC; Distrib: ST; Order: ESDA5V3L; Ordered by: STM
D8-D10 = LED0805: LED SMD 0805 K1A2
FB1 = BLM18: as FB2 on sheet ethernet_2
R3-R6 = R0603
  R4: Value: 1K
SB1 = FSMSM: SMD Switch 2-Leads
U5 = MX25L1606EMI-12G: FLASH 16M SPI 86MHZ 16SOP
XS3 = USB-Micro B
XS4 = PLD1.27-10-MCU
ZQ1 = Crystal: DST210A
ZQ2 = Crystal_4: DSX321G

## Sheet dwm.SchDoc
size A4; Scale: 1:1; DocumentType: Схема электрическая принципиальная; FirstReferrence: АБВГ.123456.001
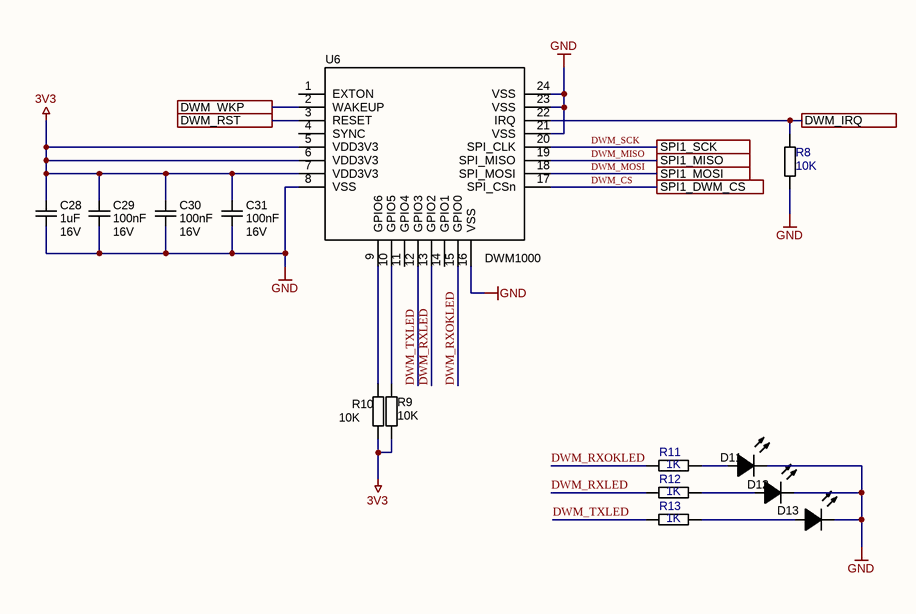
[diagram p3: dwm.SchDoc]

### Parts
C28  value 1uF  Voltage: 16V  [C0603]  (hidden comment: C0603)
C29  value 100nF  Voltage: 16V  [C0603]  (hidden comment: C0603)
C30  value 100nF  Voltage: 16V  [C0603]  (hidden comment: C0603)
C31  value 100nF  Voltage: 16V  [C0603]  (hidden comment: C0603)
D11  LED0805  [LED0805]  (value not drawn)
D12  LED0805  [LED0805]  (value not drawn)
D13  LED0805  [LED0805]  (value not drawn)
R8  10K  [SMD0603]
R9  value 10K  [SMD0603]  (hidden comment: R0603)
R10  value 10K  [SMD0603]  (hidden comment: R0603)
R11  1K  [SMD0603]
R12  1K  [SMD0603]
R13  1K  [SMD0603]
U6  DWM1000  [DWM1000]

### Ports
DWM_IRQ, DWM_RST, DWM_WKP, SPI1_DWM_CS, SPI1_MISO, SPI1_MOSI, SPI1_SCK

### Nets
3V3: C28.1 C29.1 C30.1 C31.1 R9.2 R10.2 U6.5(VDD3V3) U6.6(VDD3V3) U6.7(VDD3V3)
GND: C28.2 C29.2 C30.2 C31.2 D11.1(K) D12.1(K) D13.1(K) R8.1 U6.8(VSS) U6.16(VSS) U6.21(VSS) U6.23(VSS) U6.24(VSS)
DWM_CS: U6.17(SPI_CSn) ; port SPI1_DWM_CS
DWM_MISO: U6.19(SPI_MISO) ; port SPI1_MISO
DWM_MOSI: U6.18(SPI_MOSI) ; port SPI1_MOSI
DWM_RXLED: R12.2 U6.13(GPIO2)
DWM_RXOKLED: R11.2 U6.15(GPIO0)
DWM_SCK: U6.20(SPI_CLK) ; port SPI1_SCK
DWM_TXLED: R13.2 U6.12(GPIO3)
NetD11_2: D11.2(A) R11.1
NetD12_2: D12.2(A) R12.1
NetD13_2: D13.2(A) R13.1
NetR8_2: R8.2 U6.22(IRQ) ; port DWM_IRQ
NetR9_1: R9.1 U6.10(GPIO5)
NetR10_1: R10.1 U6.9(GPIO6)
NetU4_39: U6.2(WAKEUP) ; port DWM_WKP
NetU4_40: U6.3(RESET) ; port DWM_RST

Not connected (* = marked no-connect by the designer): U6 1(EXTON) 4(SYNC) 11(GPIO4) 14(GPIO1)

### Notes on the sheet
- Title
- Size:
- Date:
- A4
- Number:
- Time:
- Revision:
- Sheet
- of
- File:

### Library data of the parts
D11-D13 = LED0805: LED SMD 0805 K1A2
R8 = R0603: Value: 1K
R11-R13 = R0603: Value: 1K
U6 = DWM1000: MOD IEEE802.15.4-2011 UWB TXRX; Manufacturer: Decawave Limited; Frequency: 3.5GHz ~ 6.5GHz; Data Rate: 6.8Mbps; Serial Interfaces: SPI; Antenna Type: Integrated, Chip; Voltage - Supply: 2.8 V ~ 3.6 V; Current - Receiving: 64mA; Current - Transmitting: 31mA; Supplier 1: Digi-Key; Manufacturer Part Number: DWM1000; RoHS: RoHS Compliant; Category: RF/IF and RFID; Stock 1: 1028; Pricing 1: 1=32.16, 10=26.704, 100=24.24, 250=22.51296 (USD); Packaging: Cut Tape (CT); RF Family/Standard: 802.15.4; Protocol: -; Modulation: -; Power - Output: -; Sensitivity: -; Memory Size: -; Mounting Type: Surface Mount; Operating Temperature: -40°C ~ 85°C; Package / Case: Module; ComponentLink1URL: http://www.decawave.com/sites/default/files/product-pdf/dwm1000-product-brief.pdf; ComponentLink1Description: http://www.decawave.com/sites/default/files/product-pdf/dwm1000-product-brief.pdf; Supplier Part Number 1: 1479-1002-1-ND
C28-C31 = C0603: Model: *

## Sheet imu.SchDoc
size A4; Scale: 1:1; DocumentType: Схема электрическая принципиальная; FirstReferrence: АБВГ.123456.001
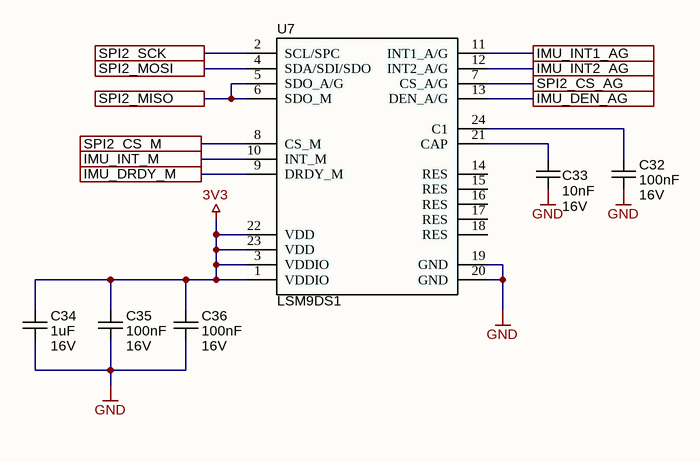
[diagram p4: imu.SchDoc]

### Parts
C32  value 100nF  Voltage: 16V  [C0603]  (hidden comment: C0603)
C33  value 10nF  Voltage: 16V  [C0603]  (hidden comment: C0603)
C34  value 1uF  Voltage: 16V  [C0603]  (hidden comment: C0603)
C35  value 100nF  Voltage: 16V  [C0603]  (hidden comment: C0603)
C36  value 100nF  Voltage: 16V  [C0603]  (hidden comment: C0603)
U7  LSM9DS1  [STM-LGA-24_3500X3000X1000]

### Ports
IMU_DEN_AG, IMU_DRDY_M, IMU_INT1_AG, IMU_INT2_AG, IMU_INT_M, SPI2_CS_AG, SPI2_CS_M, SPI2_MISO, SPI2_MOSI, SPI2_SCK

### Nets
3V3: C34.1 C35.1 C36.1 U7.1(VDDIO) U7.3(VDDIO) U7.22(VDD) U7.23(VDD)
GND: C32.2 C33.1 C34.2 C35.2 C36.2 U7.19(GND) U7.20(GND)
NetC32_1: C32.1 U7.24(C1)
NetC33_2: C33.2 U7.21(CAP)
NetU4_47: U7.2(SCL/SPC) ; port SPI2_SCK
NetU4_53: U7.5(SDO_A/G) U7.6(SDO_M) ; port SPI2_MISO
NetU4_54: U7.4(SDA/SDI/SDO) ; port SPI2_MOSI
NetU4_55: U7.13(DEN_A/G) ; port IMU_DEN_AG
NetU4_56: U7.7(CS_A/G) ; port SPI2_CS_AG
NetU4_57: U7.8(CS_M) ; port SPI2_CS_M
NetU4_58: U7.9(DRDY_M) ; port IMU_DRDY_M
NetU4_59: U7.11(INT1_A/G) ; port IMU_INT1_AG
NetU4_60: U7.12(INT2_A/G) ; port IMU_INT2_AG
NetU4_61: U7.10(INT_M) ; port IMU_INT_M

Not connected (* = marked no-connect by the designer): U7 14(RES) 15(RES) 16(RES) 17(RES) 18(RES)

### Notes on the sheet
- Title
- Size:
- Date:
- A4
- Number:
- Time:
- Revision:
- Sheet
- of
- File:

### Library data of the parts
U7 = STM-LSM9DS1-24
C32-C36 = C0603: Model: *

## Nets that join several sheets
3V3: base-board_2 (SW1.2 SW1.5), ethernet_2 (13 pins), mcu (20 pins), dwm (9 pins), imu (7 pins)
5V_POE: base-board_2 (D1.1), ethernet_2 (7 pins)
GND: base-board_2 (26 pins), ethernet_2 (31 pins), mcu (38 pins), dwm (13 pins), imu (7 pins)
USB_VBUS: base-board_2 (D4.1), mcu (D7.1 R3.1 XS3.1)
DWM_CS: mcu (U4.29), dwm (U6.17)
DWM_MISO: mcu (U4.31), dwm (U6.19)
DWM_MOSI: mcu (U4.91), dwm (U6.18)
DWM_SCK: mcu (U4.30), dwm (U6.20)
NetR8_2: mcu (U4.41), dwm (R8.2 U6.22)
NetR21_1: ethernet_2 (R21.1 U8.12), mcu (U4.25)
NetR22_1: ethernet_2 (R22.1 U8.14), mcu (U4.24)
NetR23_2: ethernet_2 (R23.2), mcu (U4.33)
NetR24_2: ethernet_2 (R24.2), mcu (U4.34)
NetR27_2: ethernet_2 (R27.2), mcu (U4.32)
NetU4_16: ethernet_2 (U8.13), mcu (U4.16)
NetU4_39: mcu (U4.39), dwm (U6.2)
NetU4_40: mcu (U4.40), dwm (U6.3)
NetU4_47: mcu (U4.47), imu (U7.2)
NetU4_48: ethernet_2 (U8.16), mcu (U4.48)
NetU4_51: ethernet_2 (U8.17), mcu (U4.51)
NetU4_52: ethernet_2 (U8.18), mcu (U4.52)
NetU4_53: mcu (U4.53), imu (U7.5 U7.6)
NetU4_54: mcu (U4.54), imu (U7.4)
NetU4_55: mcu (U4.55), imu (U7.13)
NetU4_56: mcu (U4.56), imu (U7.7)
NetU4_57: mcu (U4.57), imu (U7.8)
NetU4_58: mcu (U4.58), imu (U7.9)
NetU4_59: mcu (U4.59), imu (U7.11)
NetU4_60: mcu (U4.60), imu (U7.12)
NetU4_61: mcu (U4.61), imu (U7.10)
RESET: ethernet_2 (U8.15), mcu (6 pins)